# Altium schematic sheet Bottom.SchDoc
size A4; SheetNumber: 1; SheetTotal: 2
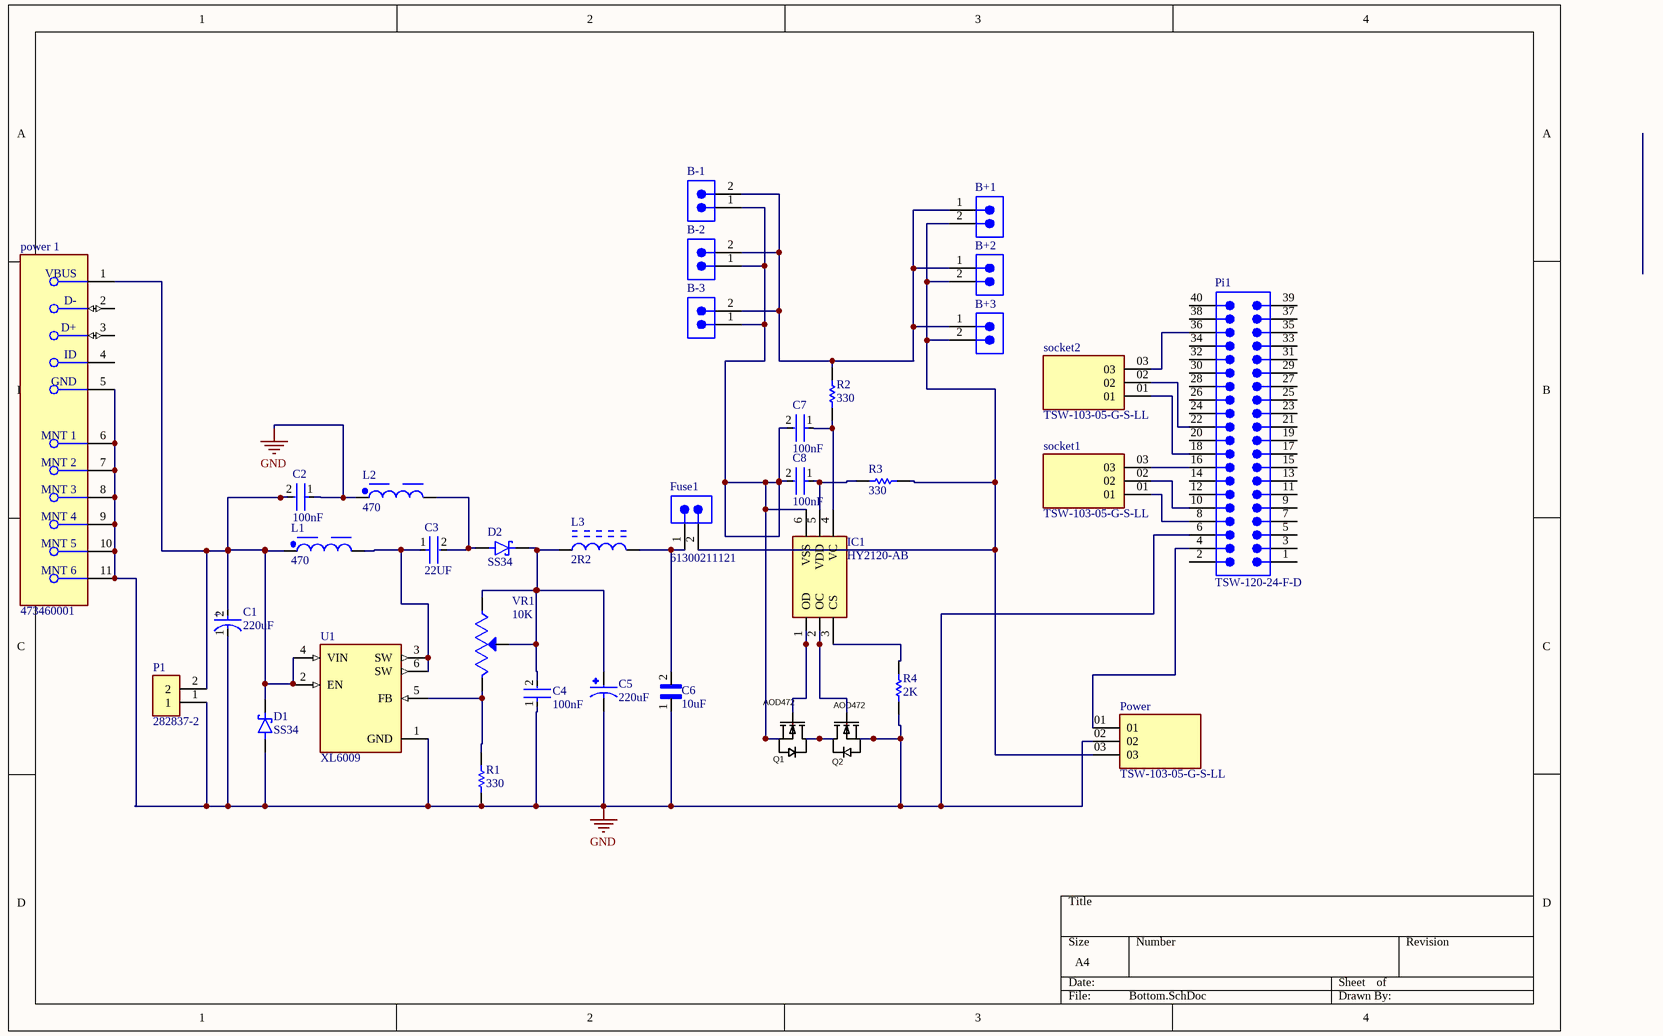
[diagram p0: Bottom.SchDoc]

## Parts
B+1  (no value)  [61300211121]
B+2  (no value)  [61300211121]
B+3  (no value)  [61300211121]
B-1  (no value)  [61300211121]
B-2  (no value)  [61300211121]
B-3  (no value)  [61300211121]
C1  220uF  [FP-FPF-MFG]
C2  100nF  [FP-CGA3E-0_3-0_1-MFG]
C3  22UF  [FP-1206-L_3_2_0_2-W_1_6_0-IPC_C]
C4  100nF  [FP-CGA3E-0_3-0_1-MFG]
C5  220uF  [CAP_EEETC1V221UV]
C6  10uF  [CAPC2012X145N]
C7  100nF  [FP-CGA3E-0_3-0_1-MFG]
C8  100nF  [FP-CGA3E-0_3-0_1-MFG]
D1  SS34  [DIO_SS34]
D2  SS34  [DIO_SS34]
Fuse1  61300211121  [61300211121]
IC1  HY2120-AB  [SOT95P280X140-6N]
L1  470  [WE-PD_1280]
L2  470  [WE-PD_1280]
L3  2R2  [BOUR-SRN6045_V]
P1  282837-2  [TE_282837-2]
Pi1  TSW-120-24-F-D  [SMTC-TSW-120-24-X-D]
Power  TSW-103-05-G-S-LL  [SAMTEC_TSW-103-05-G-S-LL]
power_1  473460001  [FP-473460001-MFG]
Q1  AOD472  [DPAK228P990X238-4N]
Q2  AOD472  [DPAK228P990X238-4N]
R1  330  [RESC1608X55X30LL15T15]
R2  330  [RESC1608X55X30LL15T15]
R3  330  [RESC1608X55X30LL15T15]
R4  2K  [RESC1608X55X30NL15T15]
socket1  TSW-103-05-G-S-LL  [SAMTEC_TSW-103-05-G-S-LL]
socket2  TSW-103-05-G-S-LL  [SAMTEC_TSW-103-05-G-S-LL]
U1  XL6009  [DPAK170P1435X465-6N]
VR1  10K  [TRIM_3296W1103LF]

## Nets
GND: C1.1(C) C2.1 C4.1 C5.2 C6.1 D1.A L2.1 P1.1 Pi1.6 Power.02 power_1.5(GND) power_1.6(MNT_1) power_1.7(MNT_2) power_1.8(MNT_3) power_1.9(MNT_4) power_1.10(MNT_5) power_1.11(MNT_6) Q2.3(S) R1.1 R4.1 U1.1(GND)
NetB+1_1: B+1.1 B+2.1 B+3.1 B-1.2 B-2.2 B-3.2 R2.2
NetB+1_2: B+1.2 B+2.2 B+3.2 Fuse1.2 Power.03 R3.2
NetB-1_1: B-1.1 B-2.1 B-3.1 C7.2 C8.2 IC1.6(VSS) Q1.3(S)
NetC1_2: C1.2(A) C2.2 D1.C(K) L1.1 P1.2 power_1.1(VBUS) U1.2(EN) U1.4(VIN)
NetC3_1: C3.1 L1.2 U1.3(SW) U1.6(SW)
NetC3_2: C3.2 D2.A L2.2
NetC4_2: C4.2 C5.1 D2.C(K) L3.1 VR1.1(CCW) VR1.2(WIPER)
NetC6_2: C6.2 Fuse1.1 L3.2
NetC7_1: C7.1 IC1.4(VC) R2.1
NetC8_1: C8.1 IC1.5(VDD) R3.1
NetIC1_1: IC1.1(OD) Q1.1(G)
NetIC1_2: IC1.2(OC) Q2.1(G)
NetIC1_3: IC1.3(CS) R4.2
NetPi1_4: Pi1.4 Power.01
NetPi1_8: Pi1.8 socket1.01
NetPi1_10: Pi1.10 socket1.02
NetPi1_16: Pi1.16 socket1.03
NetPi1_18: Pi1.18 socket2.01
NetPi1_22: Pi1.22 socket2.02
NetPi1_36: Pi1.36 socket2.03
NetQ1_2: Q1.2(D) Q2.2(D)
NetR1_2: R1.2 U1.5(FB) VR1.3(CW)

Not connected (* = marked no-connect by the designer): Pi1 1 2 3 5 7 9 11 12 13 14 15 17 19 20 21 23 24 25 26 27 28 29 30 31 32 33 34 35 37 38 39 40; power_1 2(D-) 3(D+) 4(ID)

## Notes on the sheet
- (in symbol CMP-2000-06215-2) +

## Library data of the parts
B+1-B+3 B-1-B-3 Fuse1 = CMP-1712-00002-6: NexarPartId: 20081794; Number of Contacts: 2; Pitch: 2.54mm; Connector Type: Male Pin; Voltage Rating: 250V; Current Rating: 3A; Gender: Male; Contact Resistance: 20mΩ; Height: 8.94mm; Lead Free: Lead Free; Number of Pins: 2; Termination: Through Hole; RoHS: Compliant; Lead Pitch: 2.54mm; REACH SVHC: No SVHC; Housing Material: PBT; Contact Mating Length: 5.9944mm; Min Operating Temperature: -40°C; Orientation: Vertical; Contact Material: Copper; Contact Gender: Male; Max Operating Temperature: 125°C; Number of Rows: 1; Number of Positions: 2; Packaging: Bulk; Contact Plating: Gold; Mount: Through Hole; Color: Black; Operating Supply Voltage: 250V
C1 = CMP-2000-06215-2: CAP ALUM 220UF 20% 35V SMD; Ripple Current (AC): 850mA; Life (Hours): 2000Hour; Polarity: Polar; ESR (Equivalent Series Resistance): 80mR; Material: Aluminium; Leakage Current: 77uA; RoHS Compliant: Yes; Number of Pins: 2; Length: 10.5mm; Height - Seated (Max): 0.402inch; Lead Pitch: 3.1mm; Construction: Cylindrical; Contact Plating: Tin; Tolerance: 20%; Voltage: 35V; REACH SVHC: No SVHC; Capacitance: 220uF; Width: 8.3mm; Max Operating Temperature: 105°C; Mount: Surface Mount; Package Quantity: 500; Min Operating Temperature: -55°C; Diameter: 8mm; Voltage Rating (DC): 35V; Packaging: Tape and Reel; Termination: SMD/SMT; Ripple Current: 850mA; Series: FP; Radiation Hardening: No; Case/Package: Radial; Voltage Rating: 35V; Height: 10.2mm; Lead Free: Lead Free
C2 C4 C7 C8 = CMP-2000-07546-2: Cap Ceramic 100nF 50V X7R 10% Pad SMD 0603 +125°C Automotive T/R; Weight: 7.1E-05oz; Composition: Ceramic; Max Operating Temperature: 125°C; Termination: SMD/SMT; Dielectric: X7R; Length: 1.6mm; Package Quantity: 1; REACH SVHC: No SVHC; Lead Free: Lead Free; Case Code (Metric): 1608; Min Operating Temperature: -55°C; Packaging: Tape and Reel; Tolerance: 10%; Voltage Rating: 50V; Case Code (Imperial): 0603; Capacitance: 100nF; Case/Package: 0603; Voltage Rating (DC): 50V; Depth: 0.8mm; Radiation Hardening: No; Ratings: AEC-Q200; Mount: Surface Mount; Voltage: 50V; Thickness: 0.035inch; Width: 0.8mm; Height: 0.8mm
C3 = CMP-1037-04985-3: CAP CER 22UF 6.3V X7R 1206; Tolerance: 10%; Dissipation Factor: 5%; Thickness: 0.07inch; Min Operating Temperature: -55°C; Width: 1.6mm; Case Code (Metric): 3216; Construction: Flat; Max Operating Temperature: 125°C; Case/Package: 1206; Case Code (Imperial): 1206; Lead Free: Lead Free; Capacitance: 22uF; REACH SVHC: No SVHC; Voltage Rating (DC): 6.3V; Number of Pins: 2; Contact Plating: Tin; Dielectric: X7R; Radiation Hardening: No; Depth: 1.6mm; Series: FlEXITERM; Mount: Surface Mount; Voltage Rating: 6.3V; Package Quantity: 2500; RoHS Compliant: Yes; Length: 3.2mm; Height: 1.78mm; Voltage: 6.3V; Termination: SMD/SMT; Packaging: Tape and Reel
C5 = EEETC1V221UV: CAP ALUM 220UF 20% 35V SMD; MF: Panasonic Electronic Components; MP: EEE-TC1V221UV; Check_prices: https://www.snapeda.com/parts/EEE-TC1V221UV/Panasonic/view-part/6178608/?ref=eda; Package: RADIAL-2 Panasonic; Value: *; Price: None; Availability: In Stock; SnapEDA_Link: https://www.snapeda.com/parts/EEE-TC1V221UV/Panasonic/view-part/6178608/?ref=snap; Purchase-URL: https://pricing.snapeda.com/search/part/EEE-TC1V221UV/?ref=eda
C6 = GRM21BC8YA106ME11L: 0805 10 uF 35 V Â±% 20 Tolerans X6S Ã‡ok KatmanlÄ± Seramik KondansatÃ¶r; MF: Murata; SnapEDA_Link: https://www.snapeda.com/parts/GRM21BC8YA106ME11L/Murata%20Electronics%20North%20America/view-part/1765835/?ref=snap; Availability: Good; Package: 2012 Murata; Price: None; MP: GRM21BC8YA106ME11L; Check_prices: https://www.snapeda.com/parts/GRM21BC8YA106ME11L/Murata%20Electronics%20North%20America/view-part/1765835/?ref=eda; Value: *; Purchase-URL: https://pricing.snapeda.com/search/part/GRM21BC8YA106ME11L/?ref=eda
D1 D2 = CMP-004-00031-2: 3A, 40V, Schottky Rectifier; MF: Taiwan Semiconductor; Pins: 2; Source: SS34.SchLib; MP: SS34; SnapEDA_Link: https://www.snapeda.com/parts/SS34/Taiwan+Semiconductor/view-part/?ref=snap; Check_prices: https://www.snapeda.com/parts/SS34/Taiwan+Semiconductor/view-part/?ref=eda; Component Type: Standard; Case/Package: DO-214AB-2 Taiwan Semiconductor; Value: *; Design Item ID: SS34
IC1 = HY2120-AB: Integrated Circuit; Manufacturer_Name: HYCON Tech; Datasheet Link: https://datasheet.lcsc.com/szlcsc/Fortune-Semicon-FS8205A_C16052.pdf; Height: 1.4mm; Manufacturer_Part_Number: HY2120-AB
L1 L2 = CMP-0227-00205-2: NexarPartId: 8917149; Resistance: 100mΩ; Shielding: Shielded; Saturation Current: 3A; Inductance: 47µH; Self Resonant Frequency: 7.9MHz; Tolerance: 20%; DC Resistance (DCR): 53mΩ; Test Frequency: 1kHz; Max DC Current: 2.7A; Core Material: Ferrite; Depth: 12mm; Ambient Temperature Range High: 85°C; Height - Seated (Max): 8.001mm; Max Operating Temperature: 125°C; Weight: 4.535924g; Series Resistance: 100mΩ; RoHS: Compliant; Mount: Surface Mount; Case/Package: Nonstandard; Width: 12mm; Ambient Temperature Range Low: -40°C; Current Rating: 3A; Height: 8mm; Packaging: Cut Tape (CT); Length: 12mm; Number of Pins: 2; Termination: SMD/SMT; Lead Pitch: 7mm; Lead Free: Lead Free; Inductance Tolerance: 20%; Min Operating Temperature: -40°C; REACH SVHC: Unknown; RMS Current (Irms): 2.7A; Composition: Wirewound
L3 = CMP-2000-07142-1: Semi-Shielded Power Inductor, 2.2 uH, +/- 30%, 3.5 A, -40 to 125 degC, 2-Pin SMD, RoHS, Tape and Reel; Manufacturer: Bourns; Kits: SRN-LAB1-ND / -INDUCTORKIT; Other Names: SRN6045-2R2YCT; EDA / CAD Models: DownloadfromAcceleratedDesigns; Current Rating: 3.5A; 3D Model: SRN6045.stp; Q @ Freq: 15@7.96MHz; Frequency - Self Resonant: 35MHz; PCN Assembly/Origin: MagneticproductsOct/2013; Type: Wirewound; DC Resistance (DCR): 25.1mOhmMax; Product Training Modules: SRNSeries:Semi-ShieldedInductors; Frequency - Test: 100kHz; Inductance: 2.2µH; Online Catalog: SRNSeries; Material - Core: Ferrite; Current - Saturation: 6A; Size / Dimension: 0.236"Lx0.236"W(6.00mmx6.00mm); Operating Temperature: -40°C~125°C; Height - Seated (Max): 0.177"(4.50mm); Mounting Technology: SurfaceMount; Package Description: 2-Pin Surface Mounted Device, Body 6 x 6 mm; Series: SRN6045; Packaging: CutTape(CT); Mounting Type: SurfaceMount; Shielding: Shielded; Datasheet Version: 12/2014; Category: Inductors,Coils,Chokes; Datasheet URL: http://www.bourns.com/docs/Product-Datasheets/SRN6045.pdf; Standard Package: 1; Manufacturer URL: http://www.bourns.com/; Package Reference: SRN6045; RoHS Information: SRN6045SeriesMaterialDeclaration; Family: FixedInductors; Package / Case: Nonstandard; Tolerance: ±30%
P1 = CMP-005-000000-1: Ð Ð°Ð·ÑŠÐµÐ¼Ð½Ñ‹Ðµ ÐºÐ»ÐµÐ¼Ð¼Ð½Ñ‹Ðµ ÐºÐ¾Ð»Ð¾Ð´ÐºÐ¸ Ð Ð¾Ð·ÐµÑ‚ÐºÐ° 2 Ð¿Ð¾Ð»Ð¾Ð¶ÐµÐ½Ð¸Ñ 5,08 Ð¼Ð¼ ÐŸÑ€Ð¸Ð¿Ð¾Ð¹ Ð¿Ñ€ÑÐ¼Ð¾Ð¹ Ñ‡ÐµÑ€ÐµÐ· Ð¾Ñ‚Ð²ÐµÑ€ÑÑ‚Ð¸Ðµ 13,5 Ð / ÐºÐ¾Ð½Ñ‚Ð°ÐºÑ‚; MF: TE Connectivity; SnapEDA_Link: https://www.snapeda.com/parts/282837-2/TE+Connectivity+AMP+Connectors/view-part/?ref=snap; Value: *; Pin Count: 2; Component Type: Standard; Check_prices: https://www.snapeda.com/parts/282837-2/TE+Connectivity+AMP+Connectors/view-part/?ref=eda; Price: None; Source: 282837-2.SchLib; Package: None; Availability: In Stock; MP: 282837-2; Purchase-URL: https://pricing.snapeda.com/search/part/282837-2/?ref=eda; Design Item ID: 282837-2
Pi1 = CMP-1024-00453-1: 0.025" SQ Post Header, Through-hole, Vertical, -55 to 125 degC, 2.54 mm Pitch, 40-Pin, Male, RoHS; Manufacturer: Samtec; Pitch: 2.54 mm; ComponentLink2Description: Datasheet; Temperature Range: -55 to 125 degC; RoHS: True; ComponentLink1Description: Manufacturer URL; PackageReference: TSW-120-24-X-D; ComponentLink1URL: http://www.samtec.com; PartNumber: TSW-120-24-F-D; ComponentLink3Description: Package Specification; DatasheetVersion: F-214; PackageDescription: .025[0.64] SQ. Post Terminal Strip Assembly; Mounting Technology: Through-hole; Orientation: Vertical; PackageVersion: DM, 8/1988; ComponentLink3URL: http://www.samtec.com/documents/webfiles/cpdf/TSW-XXX-XX-XXX-X-XX-XXX-MKT.pdf; ComponentLink2URL: http://www.samtec.com/documents/webfiles/pdf/TSW_TH.PDF
power_1 = CMP-2000-05246-2: CONN RCPT USB2.0 MICRO B SMD R/A; Manufacturer: Molex; Conn Orientation: Right Angle; Is Female: yes; Shielding: true; Pitch: 0.65mm; Number Of Contacts: 5; Voltage Rating: 30V; Current Rating: 1.8A; Device Class L2: USB Connectors; Digikey Description: CONN RCPT USB2.0 MICRO B SMD R/A; Height: 2.945mm; RoHS: TRUE; ComponentLink2Description: Datasheet; Octopart: https://octopart.com/47346-0001-molex-7164928; Automotive: No; Package: 0; Category: Conn; Device Class L1: Connectors; Usb Standard: USB 2.0; Temperature: -30°C to +85°C; Temperature Range Low: -30°C; Footprint Url: https://www.molex.com/pdm_docs/sd/473460001_sd.pdf; ComponentLink2URL: https://www.molex.com/webdocs/datasheets/pdf/en-us/0473460001_IO_CONNECTORS.pdf; Lead Free: Yes; Manufacturer Part Number: 473460001; Contact Material: Gold,Nickel; Temperature Range High: +85°C; Device Class L3: unset
Q1 Q2 = AOD472-VB: pin to pad: 2>4; Manufacturer: VBsemi(微碧半导体); Add into BOM: yes; Type: 1个NChannel; Drain Source On Resistance (RDS(on)@Vgs,Id): 6mΩ@4.5V,65A; Symbol: AOD472; Device: AOD472-VB; LCSC Part Name: 1个N沟道 耐压:20V 电流:65A; Supplier Part: C693172; Manufacturer Part: AOD472-VB; Supplier Footprint: TO-252-2; JLCPCB Part Class: Extended Part; Datasheet: https://atta.szlcsc.com/upload/public/pdf/source/20230505/3F73ADF2DE3058DC47170F0DD3B592B7.pdf; Supplier: LCSC; Convert to PCB: yes; Power Dissipation (Pd): -; Gate Threshold Voltage (Vgs(th)@Id): -; Total Gate Charge (Qg@Vgs): -; Input Capacitance (Ciss@Vds): -; Reverse Transfer Capacitance (Crss@Vds): -
R1-R3 = CMP-2000-00435-2: Chip Resistor, 330 Ohm, +/- 1%, 0.1 W, -55 to 155 degC, 0603 (1608 Metric), RoHS, Tape and Reel; Gender: Male; Mating Cycles: 10000; Current Rating: 500 mA; Voltage Rating: 10 V; REACH SVHC: No SVHC; PackageDescription: 2-Pin Surface Mount Device, Body 1.6 x 0.85 mm; Contact Finish: Gold; Pins: 8; ComponentLink1Description: Manufacturer URL; Packaging: Tape and Reel; Max Operating Temperature: 85 degC; Contact Material: Copper; Height: 1.45 mm; Width: 1.45 mm; DatasheetVersion: Apr-15; Package Quantity: 1500; Contact Plating: Gold; PackageReference: 0603; Mount: Surface Mount; Lead Pitch: 1.1 mm; Min Operating Temperature: -25 degC; ComponentLink1URL: http://www.panasonic.com/; ComponentLink2URL: http://industrial.panasonic.com/cdbs/www-data/pdf/RDA0000/AOA0000C86.pdf; Length: 13.7 mm; ComponentLink2Description: Datasheet; RoHSCompliant: true
R4 = CMP-2000-00317-1: Part Number: ERJ-3EKF2001V; Manufacturer: Panasonic
U1 = CMP-003-000000-1: The XL6009 regulator is a wide input range, current mode, DC/DC converter which is capable of generating either positive or negative output voltages.; MF: XLSEMI; Pin Count: 6; Component Type: Standard; Check_prices: https://www.snapeda.com/parts/XL6009/XLSEMI/view-part/?ref=eda; MP: XL6009; Availability: Not in stock; Source: XL6009.SchLib; Design Item ID: XL6009; Price: None; Value: *; Package: TO-263-5L XLSEMI; SnapEDA_Link: https://www.snapeda.com/parts/XL6009/XLSEMI/view-part/?ref=snap
VR1 = 3296W1103LF: Trimmer, Potentiometer 10kohm 25turn Thd; MF: Bourns; Package: None; MP: 3296W1103LF; Check_prices: https://www.snapeda.com/parts/3296W1103LF/Bourns/view-part/2487625/?ref=eda; Availability: Unavailable; Price: None; Value: *; SnapEDA_Link: https://www.snapeda.com/parts/3296W1103LF/Bourns/view-part/2487625/?ref=snap
Power socket1 socket2 = TSW-103-05-G-S-LL: Package: None; Price: None; Value: *; MP: TSW-103-05-G-S-LL; Availability: Unavailable